# EAGLE design MAXREFDES98_Schematic (EAGLE 9.6.2)
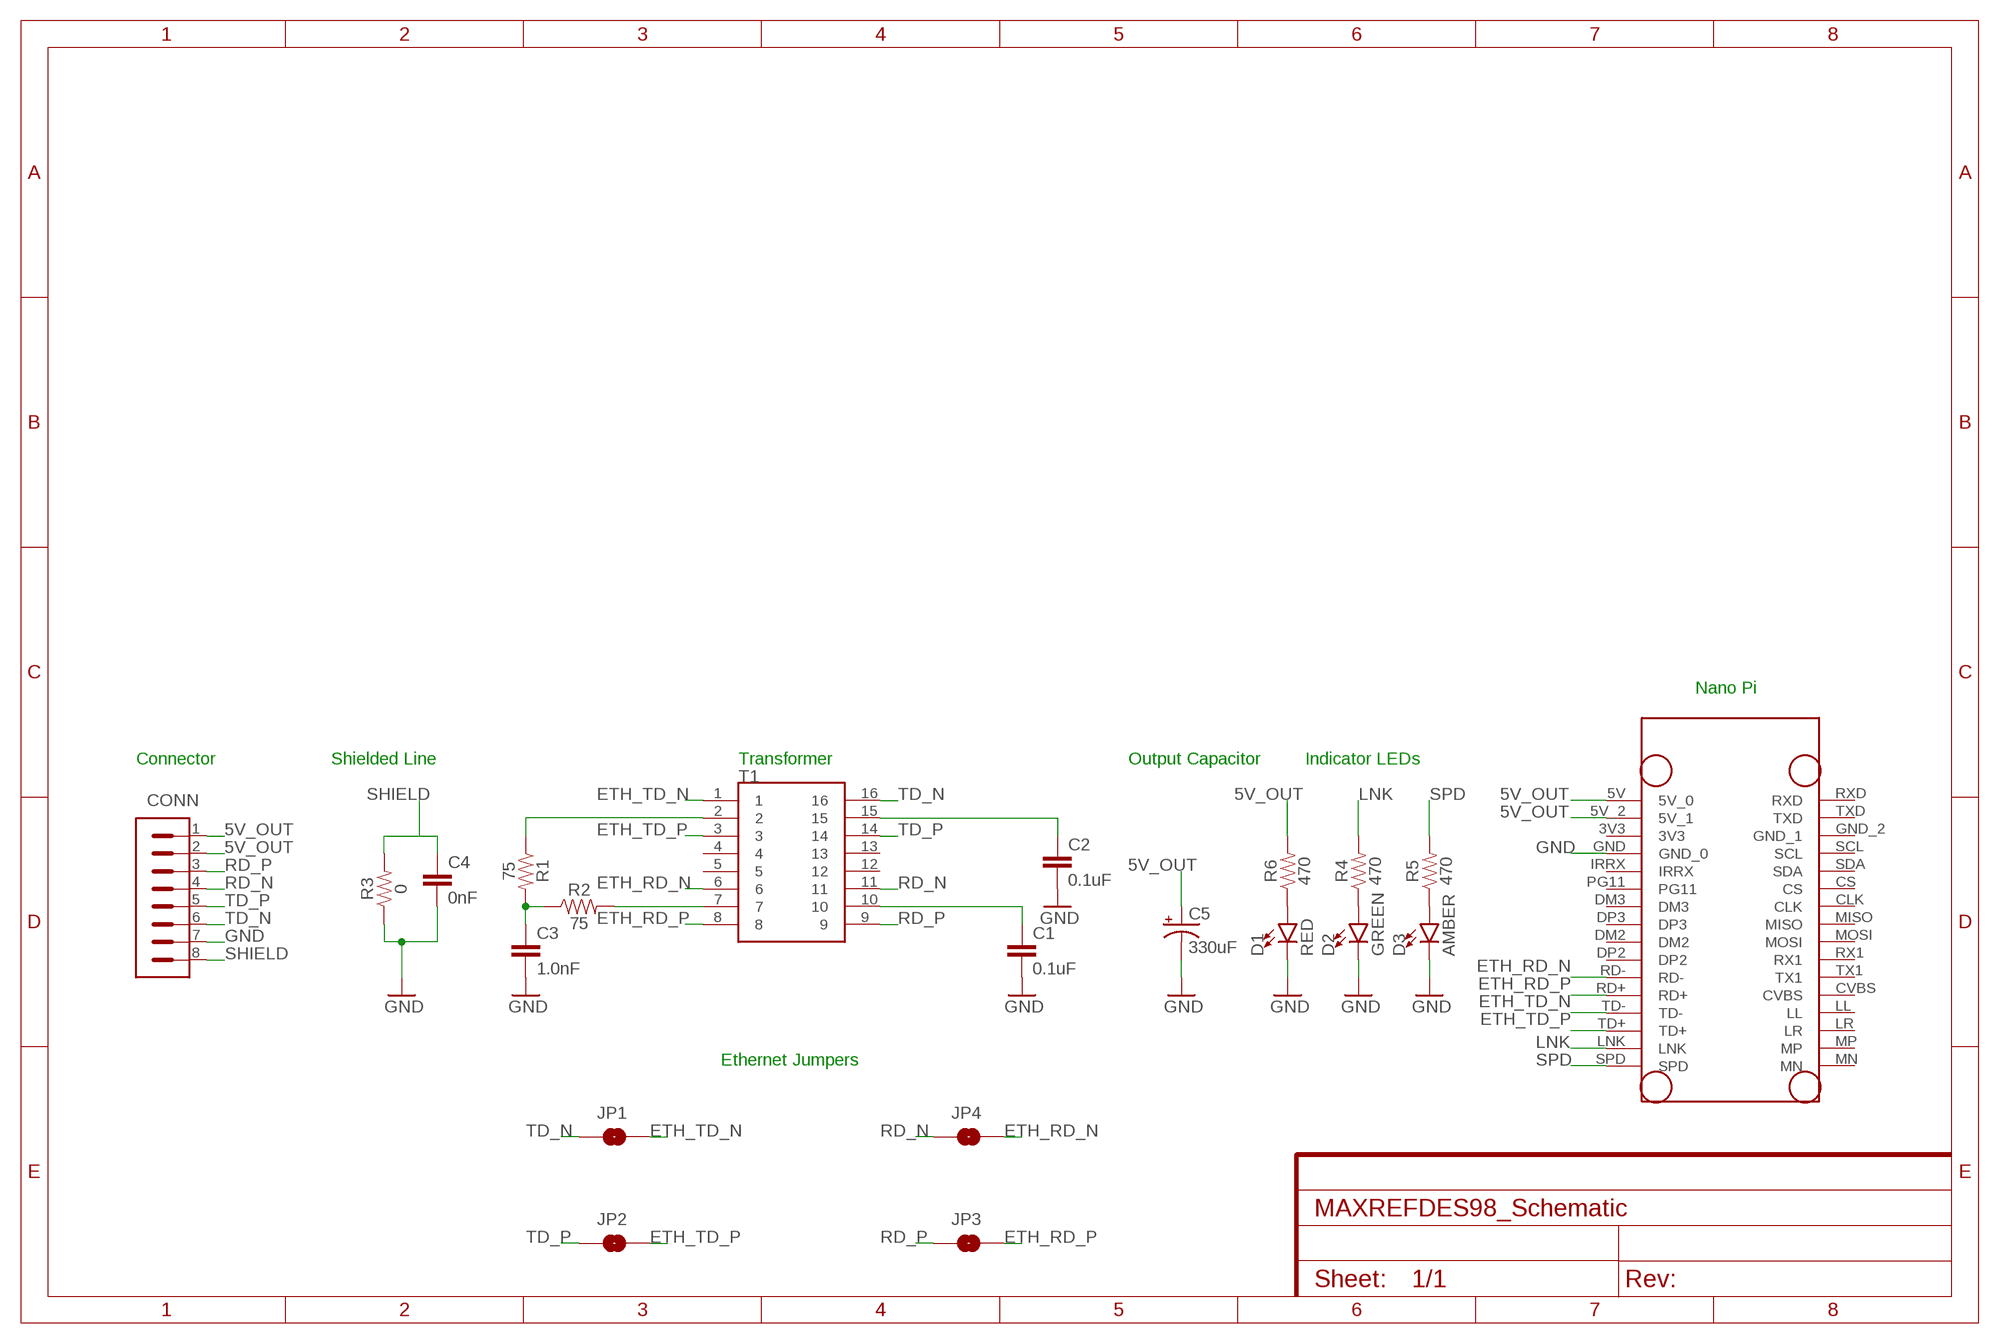
[diagram p0: schematic, sheet 1]

## Parts
C1  0.1uF  0.1UF-0603-25V-(+80/-20%)  [0603]
C2  0.1uF  0.1UF-0603-25V-(+80/-20%)  [0603]
C3  1.0nF  1.0UF-1206-50V-10%  [1206]
C4  0nF  3.3NF-0603-100V-10%  [0603]
C5  337AXZ025M  [337AXZ025M]
CONN  PXC-8-RA-1778683  [PXC-8-RA-1778683]
D1  RED  LED-FKIT-1206  [FKIT-LED-1206]
D2  GREEN  LED-FKIT-1206  [FKIT-LED-1206]
D3  AMBER  LED-FKIT-1206  [FKIT-LED-1206]
JP1  JUMPER-SMT_2_NO_NO-SILK  [SMT-JUMPER_2_NO_NO-SILK]
JP2  JUMPER-SMT_2_NO_NO-SILK  [SMT-JUMPER_2_NO_NO-SILK]
JP3  JUMPER-SMT_2_NO_NO-SILK  [SMT-JUMPER_2_NO_NO-SILK]
JP4  JUMPER-SMT_2_NO_NO-SILK  [SMT-JUMPER_2_NO_NO-SILK]
R1  75  75KOHM-0603-1/10W-1%  [0603]
R2  75  75KOHM-0603-1/10W-1%  [0603]
R3  0  0OHM-0603-1/10W-5%  [0603]
R4  470  0OHM-0603-1/10W-5%  [0603]
R5  470  0OHM-0603-1/10W-5%  [0603]
R6  470  0OHM-0603-1/10W-5%  [0603]
T1  TG110-S055N2RL  [TG110-S055N2RL]
U$2  NANO_PI_CLEAN  [NANO_PI_CLEAN]

## Nets
5V_OUT: C5.PLUS(+) CONN.1 CONN.2 R6.2 U$2.5V(5V_0) U$2.5V_2(5V_1)
ETH_RD_N: JP4.2 T1.6 U$2.RD-
ETH_RD_P: JP3.2 T1.8 U$2.RD+
ETH_TD0_GND: C1.1 T1.10
ETH_TD1_GND: C2.1 T1.15
ETH_TD_N: JP1.2 T1.1 U$2.TD-
ETH_TD_P: JP2.2 T1.3 U$2.TD+
GND: C1.2 C2.2 C3.2 C4.2 C5.MINUS(-) CONN.7 D1.C D2.C D3.C R3.1 U$2.GND(GND_0)
LNK: R4.2 U$2.LNK
N$1: D2.A R4.1
N$2: D3.A R5.1
N$3: R2.2 T1.7
N$4: C3.1 R1.2 R2.1
N$5: D1.A R6.1
N$11: R1.1 T1.2
RD_N [diff]: CONN.4 JP4.1 T1.11
RD_P [diff]: CONN.3 JP3.1 T1.9
SHIELD: C4.1 CONN.8 R3.2
SPD: R5.2 U$2.SPD
TD_N [diff]: CONN.6 JP1.1 T1.16
TD_P [diff]: CONN.5 JP2.1 T1.14
Unconnected: T1.4 T1.5 T1.12 T1.13 U$2.3V3 U$2.CLK U$2.CS U$2.CVBS U$2.DM2 U$2.DM3 U$2.DP2 U$2.DP3 U$2.GND_2(GND_1) U$2.IRRX U$2.LL U$2.LR U$2.MISO U$2.MN U$2.MOSI U$2.MP U$2.PG11 U$2.RX1 U$2.RXD U$2.SCL U$2.SDA U$2.TX1 U$2.TXD

## Notes on the sheet
- Nano Pi
- Connector | Shielded Line | Transformer | Output Capacitor | Indicator LEDs
- Ethernet Jumpers

## Library data of the parts
C1 C2 = SparkFun-Capacitors:0.1UF: 0.1µF ceramic capacitors A capacitor is a passive two-terminal electrical component used to store electrical energy temporarily in an electric field.; PROD_ID: CAP-00810
C3 = SparkFun-Capacitors:1.0UF: 1µF ceramic capacitors A capacitor is a passive two-terminal electrical component used to store electrical energy temporarily in an electric field.; PROD_ID: CAP-09822; VALUE: 1.0uF
C4 = SparkFun-Capacitors:3.3NF: 3.3nF ceramic capacitors A capacitor is a passive two-terminal electrical component used to store electrical energy temporarily in an electric field.; PROD_ID: CAP-09633; VALUE: 3.3nF
C5 = CameraBoard_Library:337AXZ025M
CONN = Phoenix Contact PTSM 8 pin:PXC-8-RA-1778683
D1-D3 = SparkFun-LED:LED: LED (Generic) Standard schematic elements and footprints for 5mm, 3mm, 1206, and 0603 sized LEDs. Generic LEDs with no color specified.
JP1-JP4 = SparkFun-Jumpers:JUMPER-SMT_2_NO: Normally open jumper This jumper has two pads in close proximity to each other. Apply solder to close the connection. Round pads are easier to solder for beginners, but are a lot larger. SparkFun Product that uses the round pads: SparkFun EL Sequencer <https://www.sparkfun.com/products/12781>
R1 R2 = SparkFun-Resistors:75KOHM: 75Ω resistor A resistor is a passive two-terminal electrical component that implements electrical resistance as a circuit element. Resistors act to reduce current flow, and, at the same time, act to lower voltage levels within circuits. - Wikipedia; PROD_ID: RES-09737
R3 = SparkFun-Resistors:0OHM: 0Ω resistor A resistor is a passive two-terminal electrical component that implements electrical resistance as a circuit element. Resistors act to reduce current flow, and, at the same time, act to lower voltage levels within circuits. - Wikipedia; PROD_ID: RES-08609
R4-R6 = SparkFun-Resistors:0OHM: 0Ω resistor A resistor is a passive two-terminal electrical component that implements electrical resistance as a circuit element. Resistors act to reduce current flow, and, at the same time, act to lower voltage levels within circuits. - Wikipedia; PROD_ID: RES-08609; VALUE: 0
T1 = CameraBoard_Library:TG110-S055N2RL
U$2 = CameraBoard_Library:NANO_PI_CLEAN

## Net classes
0 default: width 0.203 mm
1 diff: width 0.203 mm, clearance 0.203 mm

## Board
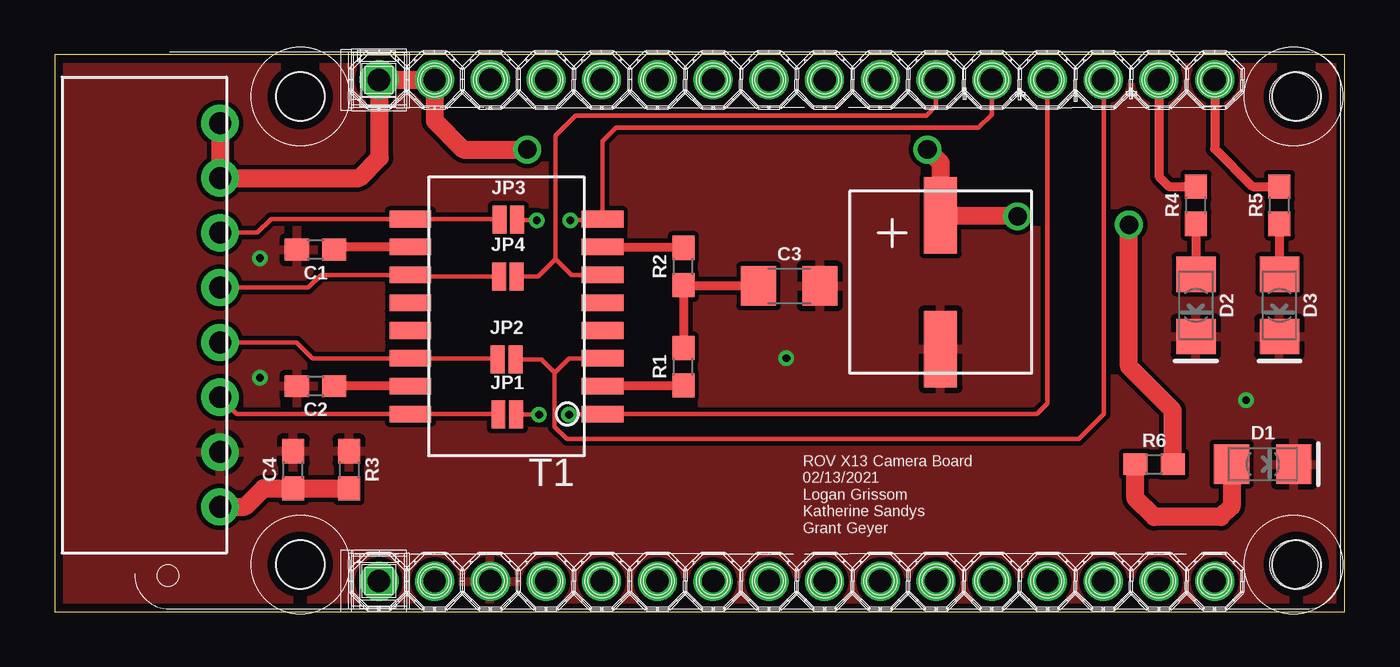
[diagram p1: board, top side]
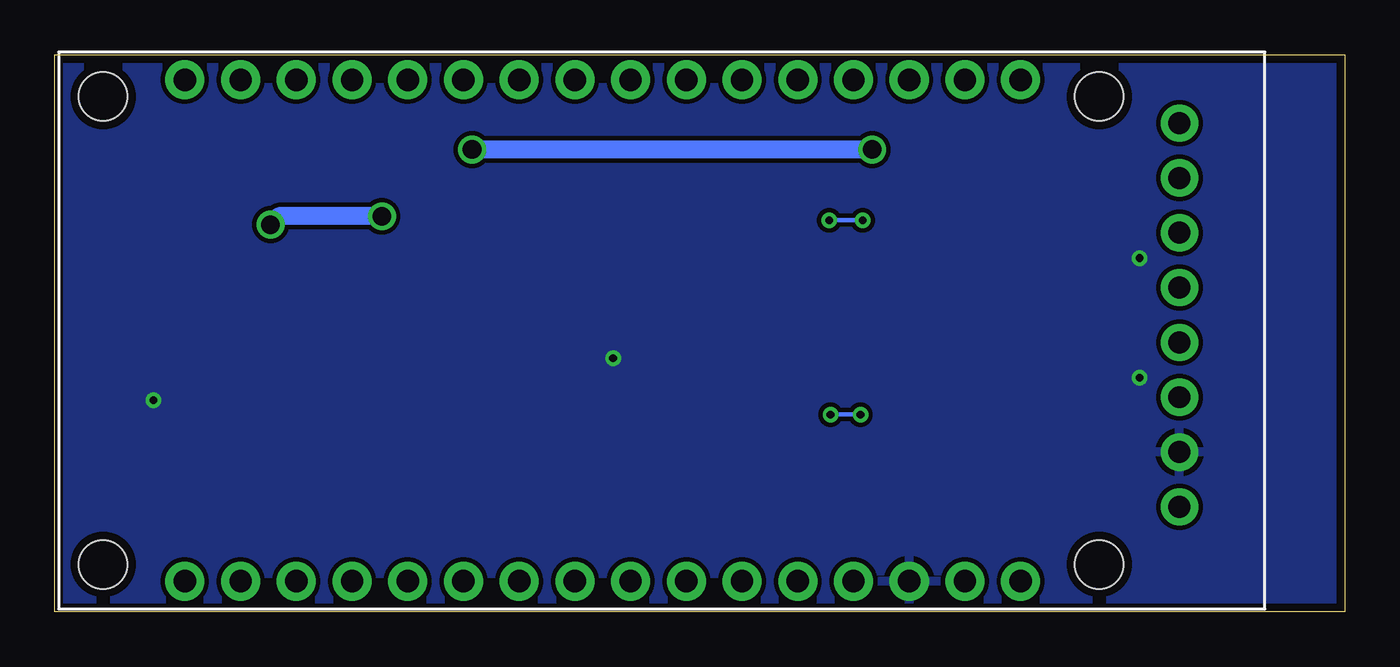
[diagram p2: board, bottom side, seen from below]

Size 58.8 x 25.4 mm. Coordinates in mm from the lower left corner, seen from the top.
Outline: 0,0 58.8,0 58.8,25.4 0,25.4 0,0
Copper layers (1*16): Top 0.0356mm / dielectric 1.5011mm / Bottom 0.0356mm
Design rules "ECE_Senior_Design": minimum track width 8mil, minimum drill 13mil, track to track 8mil, track to pad 8mil, pad to pad 6mil, via to via 8mil, smd to smd 6mil, copper to edge 15mil, drill to drill 8mil, minimum pad ring 7mil, minimum via ring 7mil, stop-mask expansion 3mil, vias tented up to drill 0mil, thermal gap 10mil

### Footprints (pad centres in the part's own frame; a part is rotated, then mirrored left to right if it is on the bottom)
0603 = smd 1.1 x 1: 1 -0.85,0; 2 0.85,0
1206 = smd 1.6 x 1.8: 1 -1.4,0; 2 1.4,0
337AXZ025M = smd 1.5 x 3.5: MINUS 0.34,3.39; PLUS 0.34,-2.71
PXC-8-RA-1778683 = drill 1 pad 1.7: 1 2.1,7.2; 2 4.6,7.2; 3 7.1,7.2; 4 9.6,7.2; 5 12.1,7.2; 6 14.6,7.2; 7 17.1,7.2; 8 19.6,7.2
FKIT-LED-1206 = smd 1.6 x 1.803: A -1.422,0; C 1.422,0
SMT-JUMPER_2_NO_NO-SILK = smd 0.635 x 1.27: 1 -0.406,0; 2 0.406,0
TG110-S055N2RL = smd 0.76 x 1.91: 1 1.905,0; 2 3.175,0; 3 4.445,0; 4 5.715,0; 5 6.985,0; 6 8.255,0; 7 9.525,0; 8 10.795,0; 9 10.795,8.76; 10 9.525,8.76; 11 8.255,8.76; 12 6.985,8.76; 13 5.715,8.76; 14 4.445,8.76; 15 3.175,8.76; 16 1.905,8.76
NANO_PI_CLEAN = drill 1.016 pad 1.778: 3V3 16.221,1.27; 5V 11.141,1.27; 5V_2 13.681,1.27; CLK 26.381,24.13; CS 23.841,24.13; CVBS 39.081,24.13; DM2 31.461,1.27; DM3 26.381,1.27; DP2 34.001,1.27; DP3 28.921,1.27; GND 16.221,24.13; GND_2 18.761,1.27; IRRX 21.301,1.27; LL 41.621,24.13; LNK 46.701,1.27; LR 44.161,24.13; MISO 28.921,24.13; MN 49.241,24.13; MOSI 31.461,24.13; MP 46.701,24.13; PG11 23.841,1.27; RD+ 39.081,1.27; RD- 36.541,1.27; RX1 34.001,24.13; RXD 11.141,24.13; SCL 18.761,24.13; SDA 21.301,24.13; SPD 49.241,1.27; TD+ 44.161,1.27; TD- 41.621,1.27; TX1 36.541,24.13; TXD 13.681,24.13 | hole 2.2: 52.97,2.03; 7.56,2.03; 7.56,23.37; 52.97,23.37

### Placement (x,y rotation side)
C1  11.89,16.51 180 top
C2  11.89,10.29 180 top
C3  33.48,14.86 0 top
C4  10.87,6.48 90 top
C5  40.72,15.37 180 top
CONN  0.33,24.38 270 top
D1  55.07,6.73 0 top
D2  52.02,13.97 270 top
D3  55.83,13.97 270 top
JP1  20.62,8.99 0 top
JP2  20.6,11.51 0 top
JP3  20.68,17.88 0 top
JP4  20.65,15.29 0 top
R1  28.65,11.18 90 top
R2  28.65,15.75 90 top
R3  13.41,6.48 270 top
R4  52.02,18.54 90 top
R5  55.83,18.54 90 top
R6  50.11,6.73 0 top
T1  24.97,7.11 90 top
U$2  3.63,25.53 180 bottom

### Tracks (layer width: path | path; a pad name or v marks a point on that pad's centre or on a via)
5V_OUT  (via drill 0.85)
  Top 0.813: CONN.1 CONN.2 13.89,19.78 14.81,20.7 14.81,24.22 U$2.5V U$2.5V_2 17.31,22.39 18.62,21.08 v21.54,21.08 | v43.89,18.03 43.85,18.08 C5.PLUS 40.38,20.48 v39.78,21.08 | R6.2 50.96,9.18 48.97,11.18 v48.97,17.65
  Bottom 0.813: v43.89,18.03 48.59,18.03 v48.97,17.65 | v21.54,21.08 v39.78,21.08
ETH_RD_N
  Top 0.203: T1.6 23.55,15.37 22.82,16.09 | U$2.RD- 40.17,23.08 39.73,22.63 23.75,22.63 22.83,21.72 22.83,16.1 22.82,16.09 | 22.82,16.09 22.02,15.29 JP4.2
ETH_RD_P  (via drill 0.35)
  Top 0.203: U$2.RD+ 42.71,22.67 42.11,22.07 25.58,22.07 24.97,21.46 T1.8 24.92,17.86 v23.49,17.86 | v21.97,17.86 21.11,17.86 JP3.2
  Bottom 0.203: v23.49,17.86 v21.97,17.86
ETH_TD0_GND
  Top 0.406: T1.10 12.86,16.64 C1.1
ETH_TD1_GND
  Top 0.406: T1.15 C2.1
ETH_TD_N  (via drill 0.35)
  Top 0.203: U$2.TD- 45.25,9.49 44.78,9.02 T1.1 24.94,8.99 v23.44,8.99 | JP1.2 v22.07,8.99
  Bottom 0.203: v22.07,8.99 v23.44,8.99
ETH_TD_P
  Top 0.203: T1.3 23.44,11.56 22.78,10.9 | 22.78,10.9 22.78,10.92 22.2,11.51 JP2.2 | 22.78,10.9 22.78,8.43 23.34,7.87 46.69,7.87 47.83,9.02 47.83,24.22 U$2.TD+
GND  (via drill 0.35)
  other vias: 33.35,11.56 54.31,9.65 9.35,16.13 9.35,10.67
  pour Top: -0.23,25.91 -0.23,-0.51 59.13,-0.51 59.13,25.91
  pour Bottom (rank 2): -0.23,25.91 59.13,25.91 59.13,-0.51 -0.23,-0.51
LNK
  Top 0.406: U$2.LNK 50.33,19.85 50.79,19.39 R4.2
N$1
  Top 0.406: R4.1 D2.A
N$2
  Top 0.406: R5.1 D3.A
N$3
  Top 0.406: T1.7 28.61,16.64 R2.2
N$4
  Top 0.406: R1.2 R2.1 28.69,14.86 C3.1
N$5
  Top 0.813: D1.A 53.65,4.8 53.16,4.32 50.11,4.32 49.26,5.17 R6.1
N$11
  Top 0.406: T1.2 25.01,10.33 R1.1
RD_N
  Top 0.203: CONN.4 11.56,14.78 12.14,15.37 T1.11 16.28,15.29 JP4.1
RD_P
  Top 0.203: CONN.3 9.23,17.28 9.86,17.91 T1.9 20.24,17.91 JP3.1
SHIELD
  Top 0.813: CONN.8 8.67,4.78 9.51,5.63 C4.1 R3.2
SPD
  Top 0.406: U$2.SPD 52.87,21.12 54.6,19.39 R5.2
TD_N
  Top 0.203: CONN.6 8.3,9.02 T1.16 20.19,9.02 JP1.1
TD_P
  Top 0.203: CONN.5 11.03,12.28 11.76,11.56 T1.14 20.14,11.56 JP2.1

### Text on the board
tNames: ROV X13 Camera Board / 02/13/2021 / Logan Grissom / Katherine Sandys / Grant Geyer